# EAGLE schematic 11-5 (EAGLE 6.5.0)
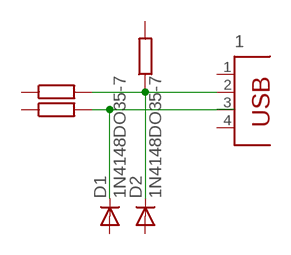
[diagram p0: schematic, sheet 1]

## Parts
1  PN61729  [PN61729]
D1  1N4148DO35-7  [DO35-7]
D2  1N4148DO35-7  [DO35-7]

## Nets
N$1: 1.2 D2.C
N$3: 1.3 D1.C
Unconnected: 1.1 1.4 D1.A D2.A

## Library data of the parts
1 = con-berg:PN61729: BERG USB connector; OC_FARNELL: unknown; OC_NEWARK: unknown
D1 D2 = diode:1N4148: DIODE high speed (Philips)